# Altium project ETR_CELLMETER_CELL_HOLDER.PrjPcb
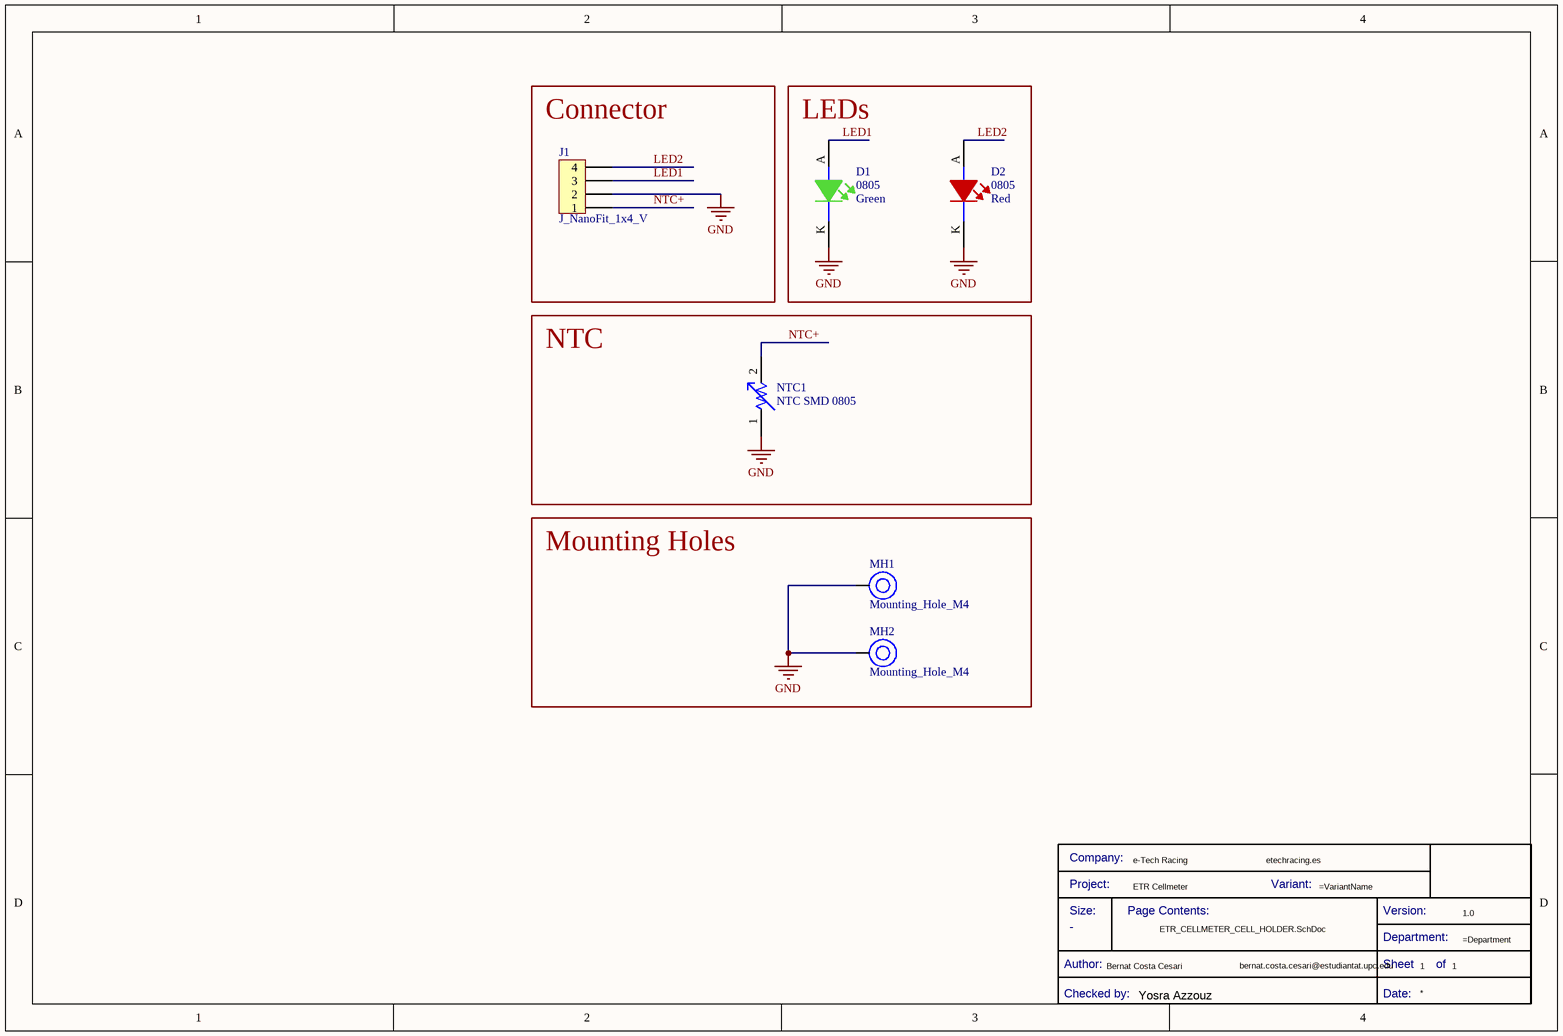
[diagram p0: ETR_CELLMETER_CELL_HOLDER.SchDoc]
Company: e-Tech Racing; Departament: ECU; DesignedByURL: etechracing.es; DesignerMail: bernat.costa.cesari@estudiantat.upc.edu; DesignerName: Bernat Costa Cesari; Project: ETR Cellmeter; ReviewerName: Yosra Azzouz; Version: 1.0
1 sheet, 7 parts. Net scope: global (net labels, ports and power ports of the same name join across sheets).
Board file: ETR_CELLMETER_CELL_HOLDER.PcbDoc

## Sheet ETR_CELLMETER_CELL_HOLDER.SchDoc
size A4; DocumentNumber: 1; SheetNumber: 1; SheetTotal: 1

### Parts
*  Checked by:: Yosra Azzouz  (hidden comment: Title Block_template)  (graphical)
D1  0805  Color: Green  [LED_0805_WE]
D2  0805  Color: Red  [LED_0805_WE]
J1  J_NanoFit_1x4_V  [J_NanoFit_1x4_V]
MH1  Mounting_Hole_M4  [Mounting_Hole_M4]
MH2  Mounting_Hole_M4  [Mounting_Hole_M4]
NTC1  NTC SMD 0805  [RESC2012X10N]

### Blocks framed on the sheet
Connector: J1
LEDs: D1 D2
NTC: NTC1
Mounting Holes: MH1 MH2

### Nets
GND: D1.K D2.K J1.2 MH1.1 MH2.1 NTC1.1
LED1: D1.A J1.3
LED2: D2.A J1.4
NTC+: J1.1 NTC1.2

### Notes on the sheet
- (in symbol CMP-00043-2) Company:; Project:; Variant:; Size:; Page Contents:; Version:; Department:; Author:; Sheet; of; Checked by:; Date:

### Library data of the parts
* = CMP-00043-2: Standard Title Block; .Creator: GP; Size: -; Design Item ID: Title Block_template; Category: Title Block; .PCBcheck: GP; Source: e-Tech_Racing.SchLib; .SCHcheck: GP
D1 = CMP-00131-2: Led, Green, 520 Nm, 3.2 V, 30 Ma, 450 Mcd Rohs Compliant: Yes; Manufacturer 1: Wurth Electronics; Manufacturer Part Number 1: 150080GS75000; Viewing Angle: 140°; Test Current: 20mA; Dominant Wavelength: 520nm; Forward Voltage: 3.2V; Forward Current: 30mA; Luminous Intensity: 450mcd; Lens Style: Clear,Rectangular; .Creator: GP; Min Operating Temperature: -40°C; Case Code (Metric): 2012; RoHS Compliant: Yes; Case Code (Imperial): 0805; Mount: Surface Mount; Length: 2mm; ComponentLink3URL: https://datasheet.ciiva.com/29563/150080gs75000-29563008.pdf?src-supplier=Digi-Key; REACH SVHC: Unknown; RoHS: Yes; Pricing 1: 50=0,19300, 500=0,12900, 1000=0,12300, 2000=0,11700, 4000=0,11100 (USD); Max Operating Temperature: 85°C; Case/Package: 0805; ComponentLink3Description: https://datasheet.ciiva.com/29563/150080gs75000-29563008.pdf?src-supplier=Digi-Key; Design Item ID: LEDGS-0805-450; ComponentLink2URL: https://katalog.we-online.de/en/led/WL-SMCW/150080GS75000; Package Quantity: 4000; Width: 1.25mm; Source: Semiconductor.SchLib; ComponentLink1URL: https://www.we-online.com/catalog/datasheet/150080GS75000.pdf; Packaging: Cut Tape; ComponentLink1Description: Datasheet; Stock 1: 4350; Wavelength: 520nm; Category: LEDs; ComponentLink4URL: https://datasheet.ciiva.com/29279/759434-da-01-en-chipled-0805-w-kl-gruen-150080gs75000-29279039.pdf?src-supplier=Conrad; Height: 0.7mm; ComponentLink2Description: Where buy it; ComponentLink4Description: https://datasheet.ciiva.com/29279/759434-da-01-en-chipled-0805-w-kl-gruen-150080gs75000-29279039.pdf?src-supplier=Conrad
D2 = CMP-00133-1: 0805(H=0.8mm) 红色 高亮 λD=625nm VF=2V IF=30mA PD=72mW; Manufacturer 1: Wurth Electronics; Manufacturer Part Number 1: 150080RS75000; Forward Current: 30mA; Viewing Angle: 140°; .Creator: DR; Forward Voltage: 2V; Dominant Wavelength: 625nm; Luminous Intensity: 150mcd; Test Current: 20mA; Lens Style: Clear,Rectangular; ComponentLink4URL: https://datasheet.ciiva.com/29279/759435-da-01-en-chipled-0805-w-kl-rot-150080rs75000-29279032.pdf?src-supplier=Conrad; ComponentLink2Description: Where buy it; Case/Package: 0805; Category: LEDs; ComponentLink3URL: https://datasheet.ciiva.com/22656/150080rs75000-22656961.pdf?src-supplier=Element14; Height: 0.7mm; Case Code (Metric): 2012; Min Operating Temperature: -40°C; ComponentLink3Description: https://datasheet.ciiva.com/22656/150080rs75000-22656961.pdf?src-supplier=Element14; Stock 1: 1; Width: 1.25mm; RoHS Compliant: Yes; Max Operating Temperature: 85°C; Design Item ID: LEDRS-0805-150; ComponentLink2URL: https://katalog.we-online.de/en/led/WL-SMCW/150080RS75000; Packaging: Tape and Reel; ComponentLink1Description: Datasheet; Wavelength: 625nm; Case Code (Imperial): 0805; RoHS: Yes; Source: Semiconductor.SchLib; ComponentLink4Description: https://datasheet.ciiva.com/29279/759435-da-01-en-chipled-0805-w-kl-rot-150080rs75000-29279032.pdf?src-supplier=Conrad; REACH SVHC: Unknown; Pricing 1: 50=0,19300, 500=0,12900, 1000=0,12300, 2000=0,11700, 4000=0,11100 (USD); Package Quantity: 4000; Length: 2mm; Mount: Surface Mount; ComponentLink1URL: https://www.we-online.com/catalog/datasheet/150080RS75000.pdf
J1 = CMP-00018-1: Nano-Fit Vertical Header Through Hole 2.50mm Pitch Single Row 4 Circuits with Kinked Pins 0.38; Manufacturer 1: Molex; Manufacturer Part Number 1: 105309-1204; .Creator: DO; Pricing 1: 1=1,37050, 10=1,11700, 100=0,95270, 500=0,86980, 1000=0,74060, 2500=0,71930, 5000=0,68450, 10000=0,66860 (USD); ComponentLink2URL: http://www.farnell.com/datasheets/2221349.pdf?src-supplier=Newark; ComponentLink2Description: http://www.farnell.com/datasheets/2221349.pdf?src-supplier=Newark; ComponentLink4URL: http://www.farnell.com/datasheets/2059602.pdf?src-supplier=Element14; ComponentLink3Description: http://www.literature.molex.com/SQLImages/kelmscott/Molex/PDF_Images/987651-1223.PDF?src-supplier=Digi-Key; ComponentLink1URL: http://farnell.com//datasheets/2221349.pdf?src-supplier=Farnell; Source: Electromechanical.SchLib; ComponentLink3URL: http://www.literature.molex.com/SQLImages/kelmscott/Molex/PDF_Images/987651-1223.PDF?src-supplier=Digi-Key; Category: Headers and Wire Housings; Design Item ID: J_NanoFit_1x4_V; ComponentLink4Description: http://www.farnell.com/datasheets/2059602.pdf?src-supplier=Element14; ComponentLink1Description: http://farnell.com//datasheets/2221349.pdf?src-supplier=Farnell; Stock 1: 709; RoHS: No
MH1 MH2 = CMP-00041-6: Mounting Hole M4; Source: Electromechanical.SchLib; Design Item ID: Mounting_Hole_M4
NTC1 = CMP-010-00001-1: NTC 0805 package 10kR